# EAGLE design Quadcopter_v2 (EAGLE 7.7.0)
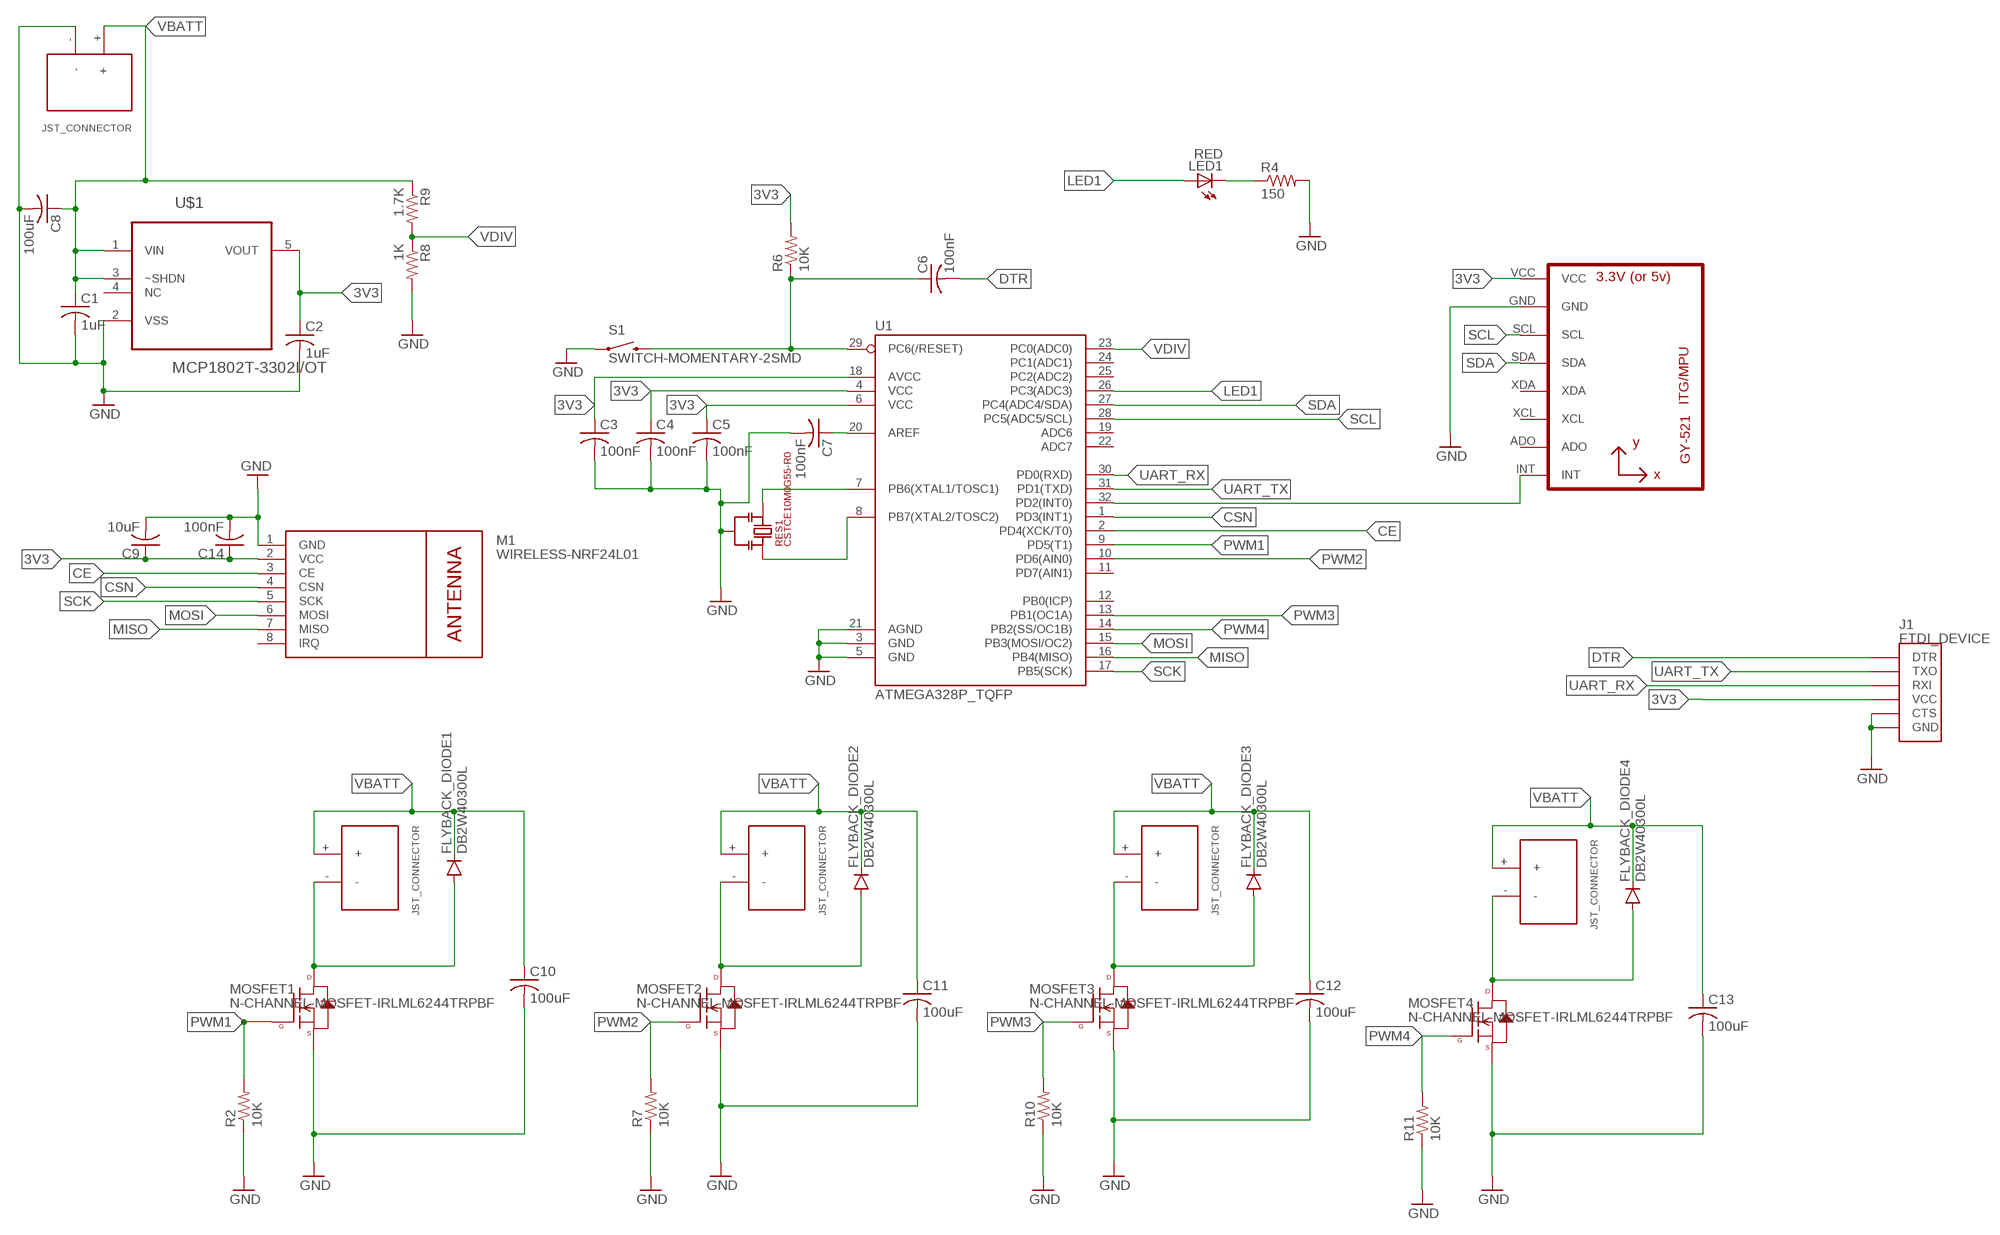
[diagram p0: schematic, sheet 1]

## Parts
C1  1uF  C-USC0603  [C0603]
C2  1uF  C-USC0603  [C0603]
C3  100nF  C-USC0603  [C0603]
C4  100nF  C-USC0603  [C0603]
C5  100nF  C-USC0603  [C0603]
C6  100nF  C-USC0603  [C0603]
C7  100nF  C-USC0603  [C0603]
C8  100uF  C-USC1210  [C1210]
C9  10uF  C-USC0603  [C0603]
C10  100uF  C-USC1210  [C1210]
C11  100uF  C-USC1210  [C1210]
C12  100uF  C-USC1210  [C1210]
C13  100uF  C-USC1210  [C1210]
C14  100nF  C-USC0603  [C0603]
FLYBACK_DIODE1  DB2W40300L  [MINI2-F3-B]
FLYBACK_DIODE2  DB2W40300L  [MINI2-F3-B]
FLYBACK_DIODE3  DB2W40300L  [MINI2-F3-B]
FLYBACK_DIODE4  DB2W40300L  [MINI2-F3-B]
J1  FTDI_DEVICE  [FTDI_DEVICE_SIDE]
LED1  RED  LEDCHIP-LED0603  [CHIP-LED0603]
M1  WIRELESS-NRF24L01  [WIRELESS-NRF24L01]
MOSFET1  N-CHANNEL-MOSFET-IRLML6244TRPBF  [SOT23-3]
MOSFET2  N-CHANNEL-MOSFET-IRLML6244TRPBF  [SOT23-3]
MOSFET3  N-CHANNEL-MOSFET-IRLML6244TRPBF  [SOT23-3]
MOSFET4  N-CHANNEL-MOSFET-IRLML6244TRPBF  [SOT23-3]
MOTOR  JST_CONNECTOR_FEMALE  [JST_CONNECTOR_FEMALE]
MOTOR1  JST_CONNECTOR_FEMALE  [JST_CONNECTOR_FEMALE]
MOTOR2  JST_CONNECTOR_FEMALE  [JST_CONNECTOR_FEMALE]
MOTOR3  JST_CONNECTOR_FEMALE  [JST_CONNECTOR_FEMALE]
R2  10K  R-US_R0603  [R0603]
R4  150  R-US_R0603  [R0603]
R6  10K  R-US_R0603  [R0603]
R7  10K  R-US_R0603  [R0603]
R8  1K  R-US_R0603  [R0603]
R9  1.7K  R-US_R0603  [R0603]
R10  10K  R-US_R0603  [R0603]
R11  10K  R-US_R0603  [R0603]
RES1  CSTCE10M0G55-R0  CSTCE-RESONATOR  [CSTCE16M0V53-R0]
S1  SWITCH-MOMENTARY-2SMD  [TACTILE-SWITCH-SMD]
U1  ATMEGA328P_TQFP  [TQFP32-08]
U3  GY-521MPU6050  [GY-521]
U$1  MCP1802T-3302I/OT  MCP1802T-3002I/OT  [SOT95P270X145-5N]
U$2  JST_Battery  JST_CONNECTOR_FEMALE  [JST_CONNECTOR_FEMALE]

## Nets
3V3: C2.1 C3.1 C4.1 C5.1 C9.1 C14.1 J1.P$4(VCC) M1.2(VCC) R6.2 U1.4(VCC) U1.6(VCC) U1.18(AVCC) U3.VCC U$1.5(VOUT)
ACC_INT: U1.32(PD2(INT0)) U3.INT
AREF: C7.1 U1.20(AREF)
CE: M1.3(CE) U1.2(PD4(XCK/T0))
CSN: M1.4(CSN) U1.1(PD3(INT1))
DRAIN1: FLYBACK_DIODE1.POS(PPIN) MOSFET1.3(D) MOTOR.-
DRAIN2: FLYBACK_DIODE2.POS(PPIN) MOSFET2.3(D) MOTOR1.-
DRAIN3: FLYBACK_DIODE3.POS(PPIN) MOSFET3.3(D) MOTOR2.-
DRAIN4: FLYBACK_DIODE4.POS(PPIN) MOSFET4.3(D) MOTOR3.-
DTR: C6.2 J1.P$1(DTR)
GND: C1.2 C2.2 C3.2 C4.2 C5.2 C7.2 C8.2 C9.2 C10.2 C11.2 C12.2 C13.2 C14.2 J1.P$5(CTS) J1.P$6(GND) M1.1(GND) MOSFET1.2(S) MOSFET2.2(S) MOSFET3.2(S) MOSFET4.2(S) R2.1 R4.2 R7.1 R8.2 R10.1 R11.1 RES1.P$2 S1.1 U1.3(GND) U1.5(GND) U1.21(AGND) U3.GND U$1.2(VSS) U$2.-
LED1: LED1.A U1.26(PC3(ADC3))
LEDRESISTOR: LED1.C R4.1
MISO: M1.7(MISO) U1.16(PB4(MISO))
MOSI: M1.6(MOSI) U1.15(PB3(MOSI/OC2))
PWM1: MOSFET1.1(G) R2.2 U1.9(PD5(T1))
PWM2: MOSFET2.1(G) R7.2 U1.10(PD6(AIN0))
PWM3: MOSFET3.1(G) R10.2 U1.13(PB1(OC1A))
PWM4: MOSFET4.1(G) R11.2 U1.14(PB2(SS/OC1B))
RST: C6.1 R6.1 S1.3 U1.29(PC6(/RESET))
SCK: M1.5(SCK) U1.17(PB5(SCK))
SCL: U1.28(PC5(ADC5/SCL)) U3.SCL
SDA: U1.27(PC4(ADC4/SDA)) U3.SDA
UART_RX: J1.P$3(RXI) U1.30(PD0(RXD))
UART_TX: J1.P$2(TXO) U1.31(PD1(TXD))
VBATT: C1.1 C8.1 C10.1 C11.1 C12.1 C13.1 FLYBACK_DIODE1.NEG(GPIN) FLYBACK_DIODE2.NEG(GPIN) FLYBACK_DIODE3.NEG(GPIN) FLYBACK_DIODE4.NEG(GPIN) MOTOR1.+ MOTOR2.+ MOTOR3.+ MOTOR.+ R9.1 U$1.1(VIN) U$1.3(~SHDN) U$2.+
VDIV: R8.1 R9.2 U1.23(PC0(ADC0))
XTAL1: RES1.P$3 U1.7(PB6(XTAL1/TOSC1))
XTAL2: RES1.P$1 U1.8(PB7(XTAL2/TOSC2))
Unconnected: M1.8(IRQ) U1.11(PD7(AIN1)) U1.12(PB0(ICP)) U1.19(ADC6) U1.22(ADC7) U1.24(PC1(ADC1)) U1.25(PC2(ADC2)) U3.ADO U3.XCL U3.XDA U$1.4(NC)

## Library data of the parts
C1-C14 = rcl:C-US: CAPACITOR, American symbol
FLYBACK_DIODE1-FLYBACK_DIODE4 = quad:DB2W40300L
J1 = quad:FTDI_DEVICE: Connector which mates to FTDI basic or FTDI cable.
LED1 = led:LED: LED OSRAM: - CHIPLED LG R971, LG N971, LY N971, LG Q971, LY Q971, LO R971, LY R971 LH N974, LH R974 LS Q976, LO Q976, LY Q976 LO Q996 - Hyper CHIPLED LW Q18S LB Q993, LB Q99A, LB R99A - SideLED LS A670, LO A670, LY A670, LG A670, LP A670 LB A673, LV A673, LT A673, LW A673 LH A674 LY A675 LS A676, LA A676, LO A676, LY A676, LW A676 LS A679, LY A679, LG A679 - Hyper Micro SIDELED® LS Y876, LA Y876, LO Y876, LY Y876 LT Y87S - SmartLED LW L88C, LW L88S LB L89C, LB L89S, LG L890 LS L89K, LO L89K, LY L89K LS L896, LA L896, LO L896, LY L896 - TOPLED LS T670, LO T670, LY T670, LG T670, LP T670 LSG T670, LSP T670, LSY T670, LOP T670, LYG T670 LG T671, LOG T671, LSG T671 LB T673, LV T673, LT T673, LW T673 LH T674 LS T676, LA T676, LO T676, LY T676, LB T676, LH T676, LSB T676, LW T676 LB T67C, LV T67C, LT T67C, LS T67K, LO T67K, LY T67K, LW E67C LS E67B, LA E67B, LO E67B, LY E67B, LB E67C, LV E67C, LT E67C LW T67C LS T679, LY T679, LG T679 LS T770, LO T770, LY T770, LG T770, LP T770 LB T773, LV T773, LT T773, LW T773 LH T774 LS E675, LA E675, LY E675, LS T675 LS T776, LA T776, LO T776, LY T776, LB T776 LHGB T686 LT T68C, LB T68C - Hyper Mini TOPLED® LB M676 - Mini TOPLED Santana® LG M470 LS M47K, LO M47K, LY M47K Source: http://www.osram.convergy.de LUXEON: - LUMILED® LXK2-PW12-R00, LXK2-PW12-S00, LXK2-PW14-U00, LXK2-PW14-V00 LXK2-PM12-R00, LXK2-PM12-S00, LXK2-PM14-U00 LXK2-PE12-Q00, LXK2-PE12-R00, LXK2-PE12-S00, LXK2-PE14-T00, LXK2-PE14-U00 LXK2-PB12-K00, LXK2-PB12-L00, LXK2-PB12-M00, LXK2-PB14-N00, LXK2-PB14-P00, LXK2-PB14-Q00 LXK2-PR12-L00, LXK2-PR12-M00, LXK2-PR14-Q00, LXK2-PR14-R00 LXK2-PD12-Q00, LXK2-PD12-R00, LXK2-PD12-S00 LXK2-PH12-R00, LXK2-PH12-S00 LXK2-PL12-P00, LXK2-PL12-Q00, LXK2-PL12-R00 Source: www.luxeon.com KINGBRIGHT: KA-3528ASYC Source: www.kingbright.com
M1 = quad:WIRELESS-NRF24L01: 2.4 GHz Wireless Module based on NRF24L01 chip
MOSFET1-MOSFET4 = quad:N-CHANNEL-MOSFET: N-Channel MOSFET Mode Field Effect Transistor; DATASHEET: http://www.mouser.com/ds/2/196/irlml6244pbf-936666.pdf; MOUSER: 942-IRLML6244TRPBF; URL: http://www.mouser.com/Search/ProductDetail.aspx?R=IRLML6244TRPBFvirtualkey57370000virtualkey942-IRLML6244TRPBF
MOTOR MOTOR1-MOTOR3 U$2 = quad:JST_CONNECTOR_FEMALE
R2 R4 R6-R11 = rcl:R-US_: RESISTOR, American symbol
RES1 = quad:CSTCE-RESONATOR: Murata Electronics Resonator
S1 = quad:SWITCH-MOMENTARY-2: Various NO switches- pushbuttons, reed, etc; PROD_ID: SWCH-08247
U1 = quad:ATMEGA328P_TQFP; PROD_ID: IC-09069
U3 = quad:GY-521
U$1 = quad:MCP1802T-3002I/OT: Low Quiescent Current LDO; MPN: MCP1802T-3002I/OT; OC_FARNELL: 1578373; OC_NEWARK: 54M4837; PACKAGE: SOT-5; SUPPLIER: Microchip

## Board
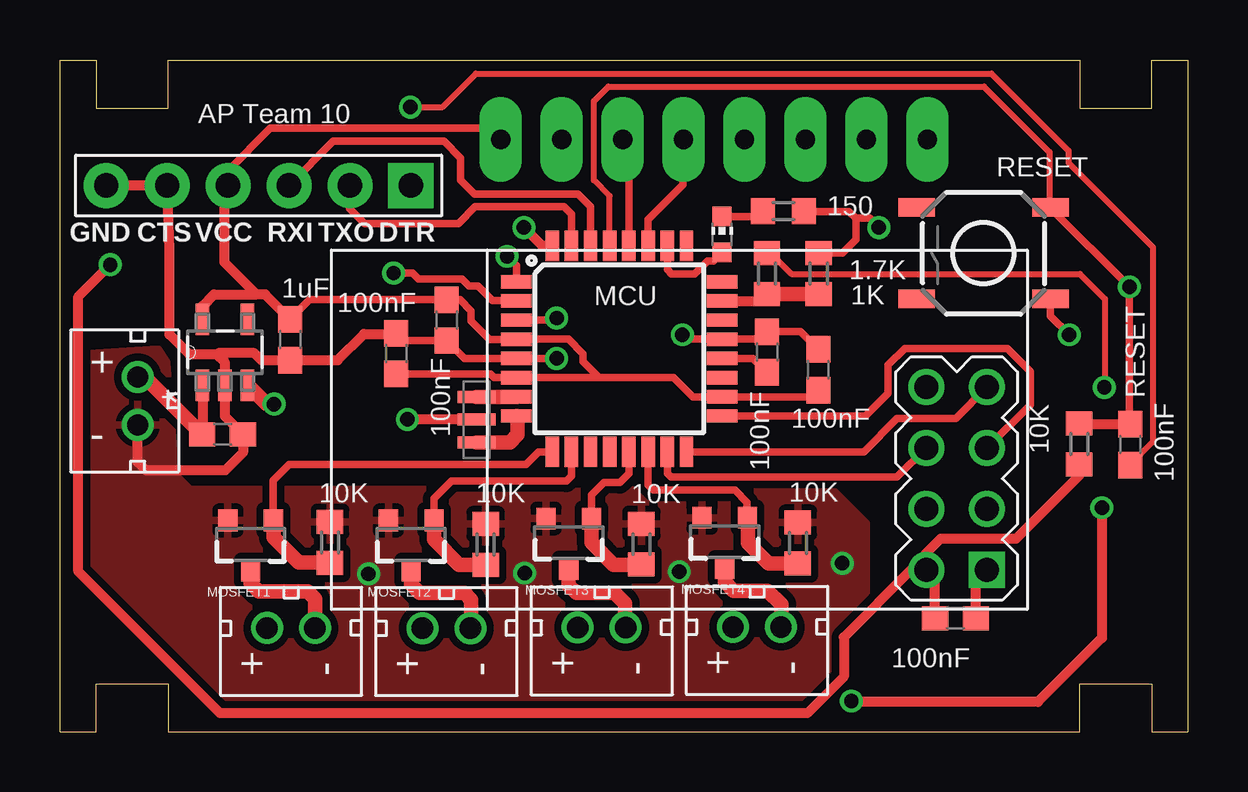
[diagram p1: board, top side]
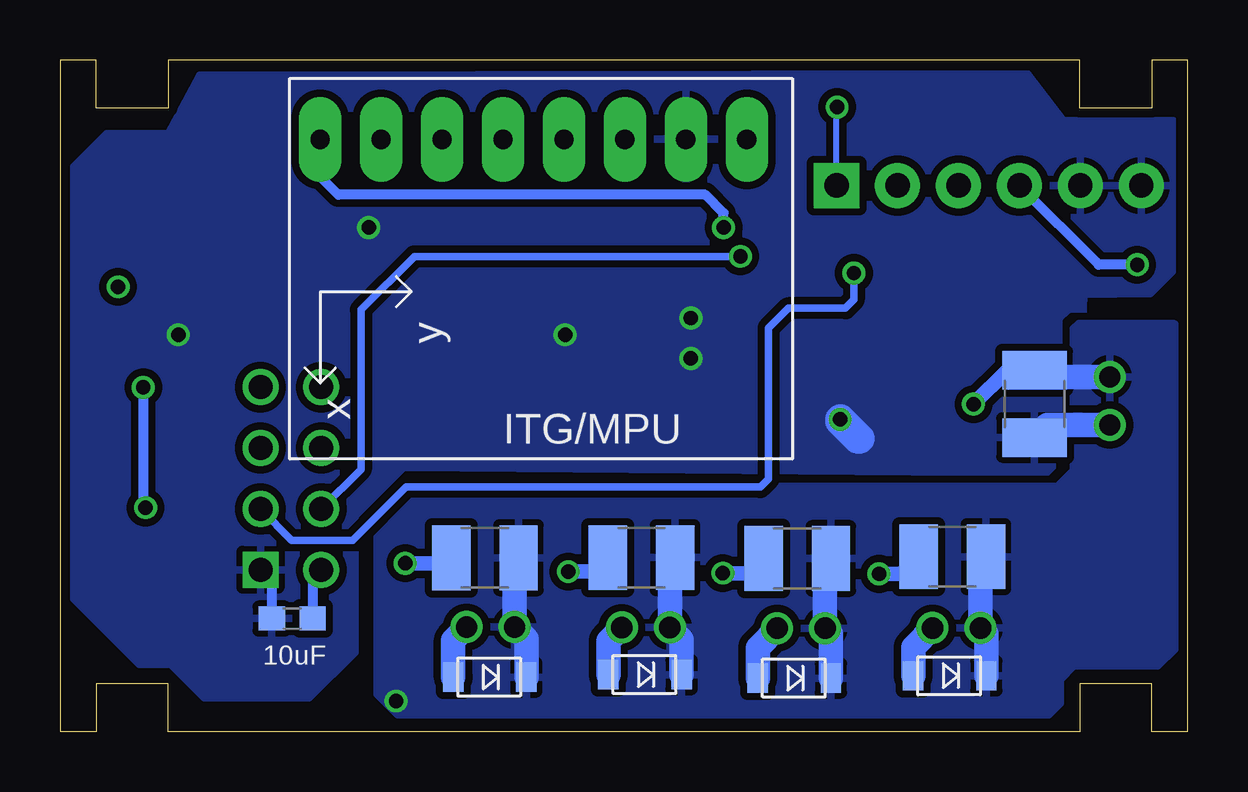
[diagram p2: board, bottom side, seen from below]

Size 47 x 28 mm. Coordinates in mm from the lower left corner, seen from the top.
Outline: 0,0 0,28 1.5,28 1.5,26 4.5,26 4.5,28 42.5,28 42.5,26 45.5,26 45.5,28 47,28 47,0 45.5,0 45.5,2 42.5,2 42.5,0 4.5,0 4.5,2 1.5,2 1.5,0 0,0
Copper layers (1*16): Top 0.0356mm / dielectric 1.5011mm / Bottom 0.0356mm
Design rules "LaenPCBOrder": minimum track width 6mil, minimum drill 13mil, track to track 6mil, track to pad 6mil, pad to pad 6mil, via to via 6mil, smd to smd 6mil, copper to edge 15mil, drill to drill 6mil, minimum pad ring 7mil, minimum via ring 7mil, stop-mask expansion 3mil, vias tented up to drill 0mil, thermal gap 10mil

### Footprints (pad centres in the part's own frame; a part is rotated, then mirrored left to right if it is on the bottom)
C0603 = smd 1.1 x 1: 1 -0.85,0; 2 0.85,0
C1210 = smd 1.6 x 2.7: 1 -1.4,0; 2 1.4,0
MINI2-F3-B = smd 1.22 x 0.85: NEG 0,1.55; POS 0,-1.5
FTDI_DEVICE_SIDE = drill 1.016 pad 1.88 square: P$1 -6.35,0 | drill 1.016 pad 1.88: P$2 -3.81,0; P$3 -1.27,0; P$4 1.27,0; P$5 3.81,0; P$6 6.35,0
CHIP-LED0603 = smd 0.8 x 0.8: A 0,-0.75; C 0,0.75
WIRELESS-NRF24L01 = drill 1 square: 1 -12.7,6.35 | drill 1: 2 -10.16,6.35; 3 -12.7,3.81; 4 -10.16,3.81; 5 -12.7,1.27; 6 -10.16,1.27; 7 -12.7,-1.27; 8 -10.16,-1.27
SOT23-3 = smd 0.8 x 0.9: 1 -0.95,-1; 2 0.95,-1; 3 0,1.1
JST_CONNECTOR_FEMALE = drill 0.889: + 0,1; - 0,-1
R0603 = smd 1 x 1.1: 1 -0.85,0; 2 0.85,0
CSTCE16M0V53-R0 = smd 1.6 x 0.5: P$1 0,0.95; P$2 0,0; P$3 0,-0.95
TACTILE-SWITCH-SMD = smd 1.524 x 0.762: 1 -2.794,1.905; 2 2.794,1.905; 3 -2.794,-1.905; 4 2.794,-1.905
TQFP32-08 = smd 1.27 x 0.559: 1 -4.293,2.8; 2 -4.293,2; 3 -4.293,1.2; 4 -4.293,0.4; 5 -4.293,-0.4; 6 -4.293,-1.2; 7 -4.293,-2; 8 -4.293,-2.8; 17 4.293,-2.8; 18 4.293,-2; 19 4.293,-1.2; 20 4.293,-0.4; 21 4.293,0.4; 22 4.293,1.2; 23 4.293,2; 24 4.293,2.8 | smd 0.559 x 1.27: 9 -2.8,-4.293; 10 -2,-4.293; 11 -1.2,-4.293; 12 -0.4,-4.293; 13 0.4,-4.293; 14 1.2,-4.293; 15 2,-4.293; 16 2.8,-4.293; 25 2.8,4.293; 26 2,4.293; 27 1.2,4.293; 28 0.4,4.293; 29 -0.4,4.293; 30 -1.2,4.293; 31 -2,4.293; 32 -2.8,4.293
GY-521 = drill 0.8 pad 1.778 long: ADO -8.89,-6.35; GND -8.89,6.35; INT -8.89,-8.89; SCL -8.89,3.81; SDA -8.89,1.27; VCC -8.89,8.89; XCL -8.89,-3.81; XDA -8.89,-1.27
SOT95P270X145-5N = smd 1.321 x 0.559: 1 -1.372,0.94; 2 -1.372,0; 3 -1.372,-0.94; 4 1.372,-0.94; 5 1.372,0.94

### Placement (x,y rotation side)
C1  6.78,12.39 0 top
C2  9.59,16.34 270 top
C3  31.61,15.08 90 top
C4  16.12,17.15 270 top
C5  14.02,15.76 90 top
C6  44.61,11.96 270 top
C7  29.48,15.82 90 top
C8  6.38,13.65 270 bottom
C9  37.32,4.72 180 bottom
C10  9.8,7.29 180 bottom
C11  16.26,7.22 180 bottom
C12  22.76,7.25 180 bottom
C13  29.29,7.25 180 bottom
C14  37.33,4.72 0 top
FLYBACK_DIODE1  9.94,2.32 270 bottom
FLYBACK_DIODE2  16.41,2.23 270 bottom
FLYBACK_DIODE3  22.64,2.37 270 bottom
FLYBACK_DIODE4  29.11,2.27 270 bottom
J1  8.28,22.76 180 top
LED1  27.6,20.73 0 top
M1  25.95,13.09 180 top
MOSFET1  7.95,7.8 180 top
MOSFET2  14.64,7.8 180 top
MOSFET3  21.21,7.88 180 top
MOSFET4  27.71,7.91 180 top
MOTOR  9.63,4.31 90 top
MOTOR1  16.1,4.31 90 top
MOTOR2  22.58,4.33 90 top
MOTOR3  29.05,4.36 90 top
R2  11.26,7.89 270 top
R4  30.16,21.7 0 top
R6  42.49,11.99 270 top
R7  17.75,7.8 270 top
R8  31.63,19.09 90 top
R9  29.47,19.09 270 top
R10  24.23,7.81 270 top
R11  30.76,7.86 270 top
RES1  17.36,13 180 top
S1  38.5,19.95 180 top
U1  23.32,15.96 0 top
U3  27.26,15.8 270 bottom
U$1  6.88,15.81 90 top
U$2  3.24,13.78 0 top

### Tracks (layer width: path | path; a pad name or v marks a point on that pad's centre or on a via)
3V3  (via drill 0.6)
  Top 0.305: C5.1 17.95,14.91 18.1,14.76 U1.6 22.48,14.76 | C3.1 31.33,13.96 U1.18 27.59,13.94 26.38,13.94 25.57,14.76 22.48,14.76 | C2.1 10.41,18 C4.1 16.67,18 17.14,17.53 17.14,17.11 17.91,16.35 U1.4 21.2,16.36 21.81,15.75 21.81,15.42 22.48,14.76 | J1.P$4 7.01,23.39 8.76,25.15 17.92,25.15 U3.VCC | 36.11,7.42 36.1,7.43
  Top 0.406: U$1.5 5.94,17.75 6.41,18.22 8.19,18.22 | C2.1 8.56,18.22 8.19,18.22 | 8.19,18.22 6.86,19.56 6.86,22.61 J1.P$4 | C14.1 36.48,6.37 M1.2 | R6.2 42.49,10.67 39.85,8.03 36.7,8.03 36.1,7.43 | M1.2 | M1.2 35.47,6.74 32.67,3.94 32.67,2.29 31.15,0.76 6.67,0.76 0.76,6.67 0.76,18.13 v2.1,19.46 | M1.2 36.11,7.42
  Bottom 0.406: M1.2 36.47,6.38 C9.1 | v2.1,19.46 3.71,19.46 J1.P$4
ACC_INT  (via drill 0.6)
  Top 0.406: U1.32 20.11,20.25 v19.34,21.02
  Bottom 0.305: U3.INT 36.15,23.14 36.1,23.08
  Bottom 0.406: v19.34,21.02 19.34,21.62 20.1,22.38 35.4,22.38 36.1,23.08
AREF
  Top 0.305: U1.20 28.89,15.56 C7.1
CE  (via drill 0.6)
  Top 0.305: v13.91,19.11 14.7,19.11 14.95,18.86 16.76,18.86 17.05,18.57 17.43,18.57 18.03,17.97 U1.2
  Bottom 0.305: M1.3 37.34,7.97 34.8,7.97 32.58,10.19 17.81,10.19 17.46,10.54 17.46,16.83 16.64,17.65 14.26,17.65 13.91,18 v13.91,19.11 13.91,18.95
CSN  (via drill 0.6)
  Top 0.305: v18.64,19.81 19.02,19.43 U1.1
  Bottom 0.305: v18.64,19.81 32.23,19.81 34.45,17.59 34.45,10.94 M1.4
DRAIN1
  Top 0.61: MOSFET1.3 7.95,6.18 8.29,5.84 10.32,5.84 10.64,5.52 10.64,4.32 MOTOR.-
  Bottom 1.016: FLYBACK_DIODE1.POS 11.44,3.5 MOTOR.-
DRAIN2
  Top 0.61: MOSFET2.3 14.64,6.13 14.99,5.78 16.86,5.78 17.14,5.49 17.14,4.35 MOTOR1.-
  Bottom 1.016: FLYBACK_DIODE2.POS 17.91,3.5 MOTOR1.-
DRAIN3
  Top 0.61: MOSFET3.3 21.21,6.1 21.53,5.78 23.11,5.78 23.56,5.33 23.56,4.36 MOTOR2.-
  Bottom 1.016: FLYBACK_DIODE3.POS 24.14,3.77 MOTOR2.-
DRAIN4
  Top 0.61: MOSFET4.3 27.71,6.23 28.07,5.87 29.5,5.87 30.07,5.3 30.07,4.38 MOTOR3.-
  Bottom 1.016: FLYBACK_DIODE4.POS 30.61,3.8 MOTOR3.-
DTR  (via drill 0.6)
  Top 0.254: v14.61,26.04 15.94,26.04 17.34,27.43 38.83,27.43 42.04,24.23 42.04,23.72 45.56,20.19 45.56,12.06 C6.2
  Bottom 0.254: J1.P$1 14.63,26.01 v14.61,26.04
GND  (via drill 0.6)
  Top 0.305: C5.2 14.33,16.3 C4.2 16.86,15.56 U1.5 v20.7,15.56 | C3.2 30.87,16.67 C7.2 29.16,16.36 U1.21 26.12,16.36 v25.94,16.54 | R8.2 32.61,19.94 33.18,20.51 33.18,21.4 | 33.18,21.4 32.89,21.68 31.02,21.68 R4.2 | 33.18,21.4 33.75,21.4 v34.13,21.02 | U1.3 20.62,17.16 v20.7,17.24 | S1.1 41.29,17.32 v42.07,16.54
  Top 0.406: U$2.- 3.24,11.24 3.59,10.89 6.89,10.89 7.63,11.63 C1.2 6.88,13.14 U$1.2 6.88,15.38 6.54,15.72 | 6.54,15.72 5.4,15.72 4.57,16.54 4.57,20.12 J1.P$5 J1.P$6 | 6.54,15.72 6.6,15.78 8.1,15.78 8.39,15.49 C2.2 11.58,15.49 12.67,16.57 13.98,16.57 C5.2 | C14.2 38.18,6.27 M1.1 | RES1.P$2 14.49,13 v14.48,13.02
  Bottom 0.406: M1.1 38.17,6.26 C9.2
  Bottom 0.61: v19.37,6.6 18.28,6.6 C11.2 | v12.86,6.57 11.92,6.57 C10.2 | v25.81,6.67 24.75,6.67 C12.2 | v32.61,7.02 30.91,7.02 C13.2
  Bottom 1.016: U$2.- 5.85,12.78 C8.2
  Bottom 1.27: v14.48,13.02 13.68,12.22 13.75,12.22 14.48,12.95
  pour Top (isolate 0.305): 0.51,15.72 0.57,3.49 1.27,2.79 4.89,2.79 5.33,2.35 5.33,1.17 5.81,0.7 32.8,0.7 33.62,1.52 33.62,8.67 32.19,10.1 5.43,10.1 4.83,10.7 4.45,15.37 4.45,15.4 4.1,15.94
  pour Bottom (isolate 0.305, rank 2): 0.6,25.46 5.18,25.46 6.67,27.43 41.18,27.37 42.48,24.92 45.05,24.92 46.42,23.56 46.42,5.52 43.69,2.79 42.39,2.79 40.99,1.4 36.61,1.4 34.7,3.3 34.7,8.99 32.67,11.02 4.48,10.76 4.54,13.56 4.38,16.45 4.32,18.22 1.56,18.26 0.64,19.18 0.64,25.43
LED1
  Top 0.305: U1.26 25.32,19.26 25.5,19.08 26.45,19.08 26.99,19.62 27.24,19.62 LED1.A
LEDRESISTOR
  Top 0.305: LED1.C 29.09,21.48 R4.1
MISO
  Top 0.305: U1.16 33.51,11.66 34.89,13.05 37.34,13.05 M1.7
MOSI
  Top 0.305: U1.15 25.32,10.75 25.46,10.6 34.89,10.6 M1.6
PWM1
  Top 0.305: U1.9 19.95,11.66 19.43,11.14 9.56,11.14 8.89,10.48 MOSFET1.1
  Top 0.61: MOSFET1.1 8.9,8.09 9.94,7.05 R2.2
PWM2
  Top 0.305: U1.10 21.32,10.65 21.11,10.45 16.32,10.45 15.59,9.72 MOSFET2.1
  Top 0.61: MOSFET2.1 15.59,8 16.64,6.95 R7.2
PWM3
  Top 0.305: U1.13 23.72,10.76 23.34,10.38 22.67,10.38 22.16,9.87 MOSFET3.1
  Top 0.61: MOSFET3.1 22.16,7.88 23.08,6.95 R10.2
PWM4
  Top 0.305: U1.14 24.52,10.28 24.73,10.06 28.13,10.06 28.64,9.56 28.64,8.93 MOSFET4.1
  Top 0.61: R11.2 29.54,7.01 28.67,7.87 MOSFET4.1
RST  (via drill 0.6)
  Top 0.254: U1.29 22.92,22.33 22.26,22.99 22.26,26.29 22.86,26.89 38.51,26.89 41.24,24.16 41.24,21.9 S1.3
  Top 0.305: S1.3 41.29,21.83 v44.58,18.54 44.58,12.84 C6.1
  Top 0.406: R6.1 42.52,12.81 C6.1
SCK
  Top 0.305: U1.17 33.57,13.16 34.51,14.1 34.51,15.27 35.21,15.97 39.5,15.97 40.45,15.02 40.45,13.62 M1.5
SCL
  Top 0.305: U1.28 23.72,24.43 U3.SCL
SDA
  Top 0.305: U1.27 24.52,21.34 25.97,22.8 25.97,24.67 U3.SDA
UART_RX
  Top 0.305: U1.30 22.12,21.89 21.59,22.42 17.27,22.42 16.7,22.99 16.7,23.91 16,24.61 11.39,24.61 J1.P$3
UART_TX
  Top 0.305: J1.P$2 12.06,22.74 12.06,21.81 12.7,21.18 16.61,21.18 17.3,21.88 21.02,21.88 21.32,21.58 U1.31
VBATT  (via drill 0.6)
  Top 0.254: R9.1 29.62,19.94 30.48,19.08 42.51,19.08 43.56,18.03 43.56,14.38 v43.53,14.35
  Top 0.406: U$1.1 C1.1 | v43.43,9.34 43.43,3.9 40.77,1.24 33.02,1.24 v32.99,1.27
  Top 0.61: U$2.+ 3.54,14.78 C1.1 | v8.92,13.65 8.61,13.65 U$1.3
  Bottom 0.254: 43.53,9.43 v43.43,9.34
  Bottom 0.406: v43.53,14.35 43.53,9.43
  Bottom 0.61: C8.1 7.52,15.05 v8.92,13.65
  Bottom 1.016: FLYBACK_DIODE1.NEG 8.39,4.07 MOTOR.+ 8.63,7.06 C10.1 | FLYBACK_DIODE2.NEG 14.86,4.07 MOTOR1.+ 15.1,6.98 C11.1 | FLYBACK_DIODE3.NEG 21.09,3.85 MOTOR2.+ 21.58,7.03 C12.1 | FLYBACK_DIODE4.NEG 27.56,3.87 MOTOR3.+ 28.05,7.08 C13.1 | U$2.+ 6.1,14.78 C8.1
  pour Bottom (isolate 0.305): 0.54,16.99 0.54,3.43 1.24,2.73 4.73,2.73 5.3,2.16 5.3,1.17 5.78,0.7 32.92,0.7 33.78,1.56 33.78,8.57 32.13,10.22 5.43,10.22 4.76,10.89 4.76,16.64 4.76,16.67 4.76,16.8 4.54,17.02 0.57,17.02
VDIV
  Top 0.406: U1.23 29.18,17.96 R9.2
  Top 0.61: R9.2 R8.1
XTAL1
  Top 0.61: RES1.P$3 U1.7
XTAL2
  Top 0.61: RES1.P$1 18.75,12.05 19.08,12.38 19.08,13.1 U1.8

### Text on the board
tPlace: AP Team 10 | RESET | 150 | 1.7K | 1uF | MCU | 1K | 100nF | RESET | 100nF | 100nF | 10K | 100nF | 10K | 10K | 10K | 10K | 100nF | 100nF
bPlace: 10uF